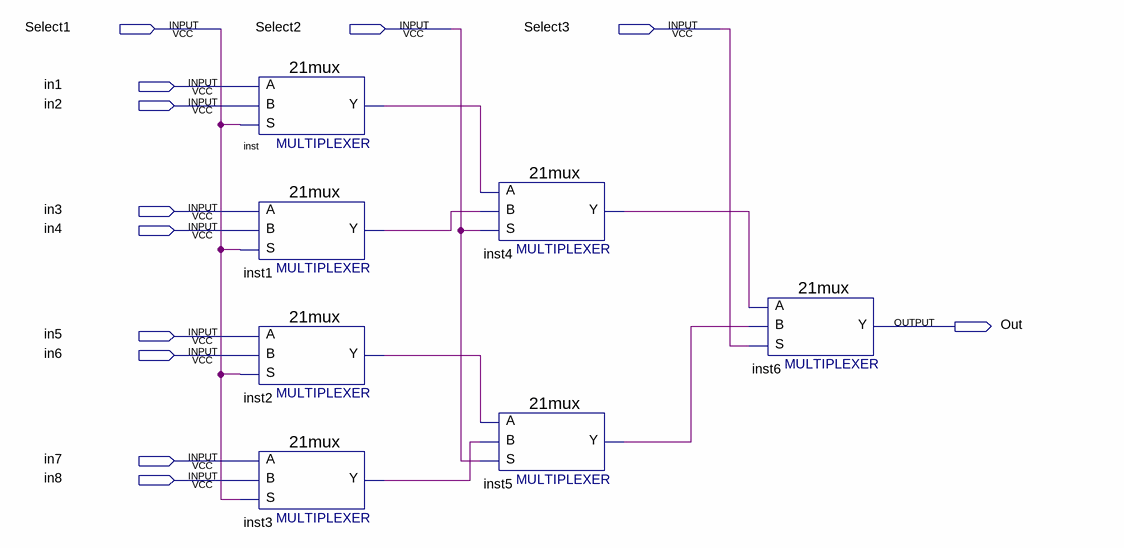
[diagram p0: schematic sheet]
// Quartus schematic 8to1mux.bdf as structural Verilog: 7 symbols, 12 pins
module \8to1mux  (
  input  Select1,
  input  Select2,
  input  Select3,
  input  in1,
  input  in2,
  input  in3,
  input  in4,
  input  in5,
  input  in6,
  input  in7,
  input  in8,
  output Out
);

  wire inst1_y, inst2_y, inst3_y, inst4_y, inst5_y, inst_y;

  \21mux  inst (.S(Select1), .B(in2), .A(in1), .Y(inst_y));
  \21mux  inst1 (.S(Select1), .B(in4), .A(in3), .Y(inst1_y));
  \21mux  inst2 (.S(Select1), .B(in6), .A(in5), .Y(inst2_y));
  \21mux  inst3 (.S(Select1), .B(in8), .A(in7), .Y(inst3_y));
  \21mux  inst4 (.S(Select2), .B(inst1_y), .A(inst_y), .Y(inst4_y));
  \21mux  inst5 (.S(Select2), .B(inst3_y), .A(inst2_y), .Y(inst5_y));
  \21mux  inst6 (.S(Select3), .B(inst5_y), .A(inst4_y), .Y(Out));
endmodule
